# EAGLE board StepperBoard (EAGLE 9.6.2), part 1 of 2
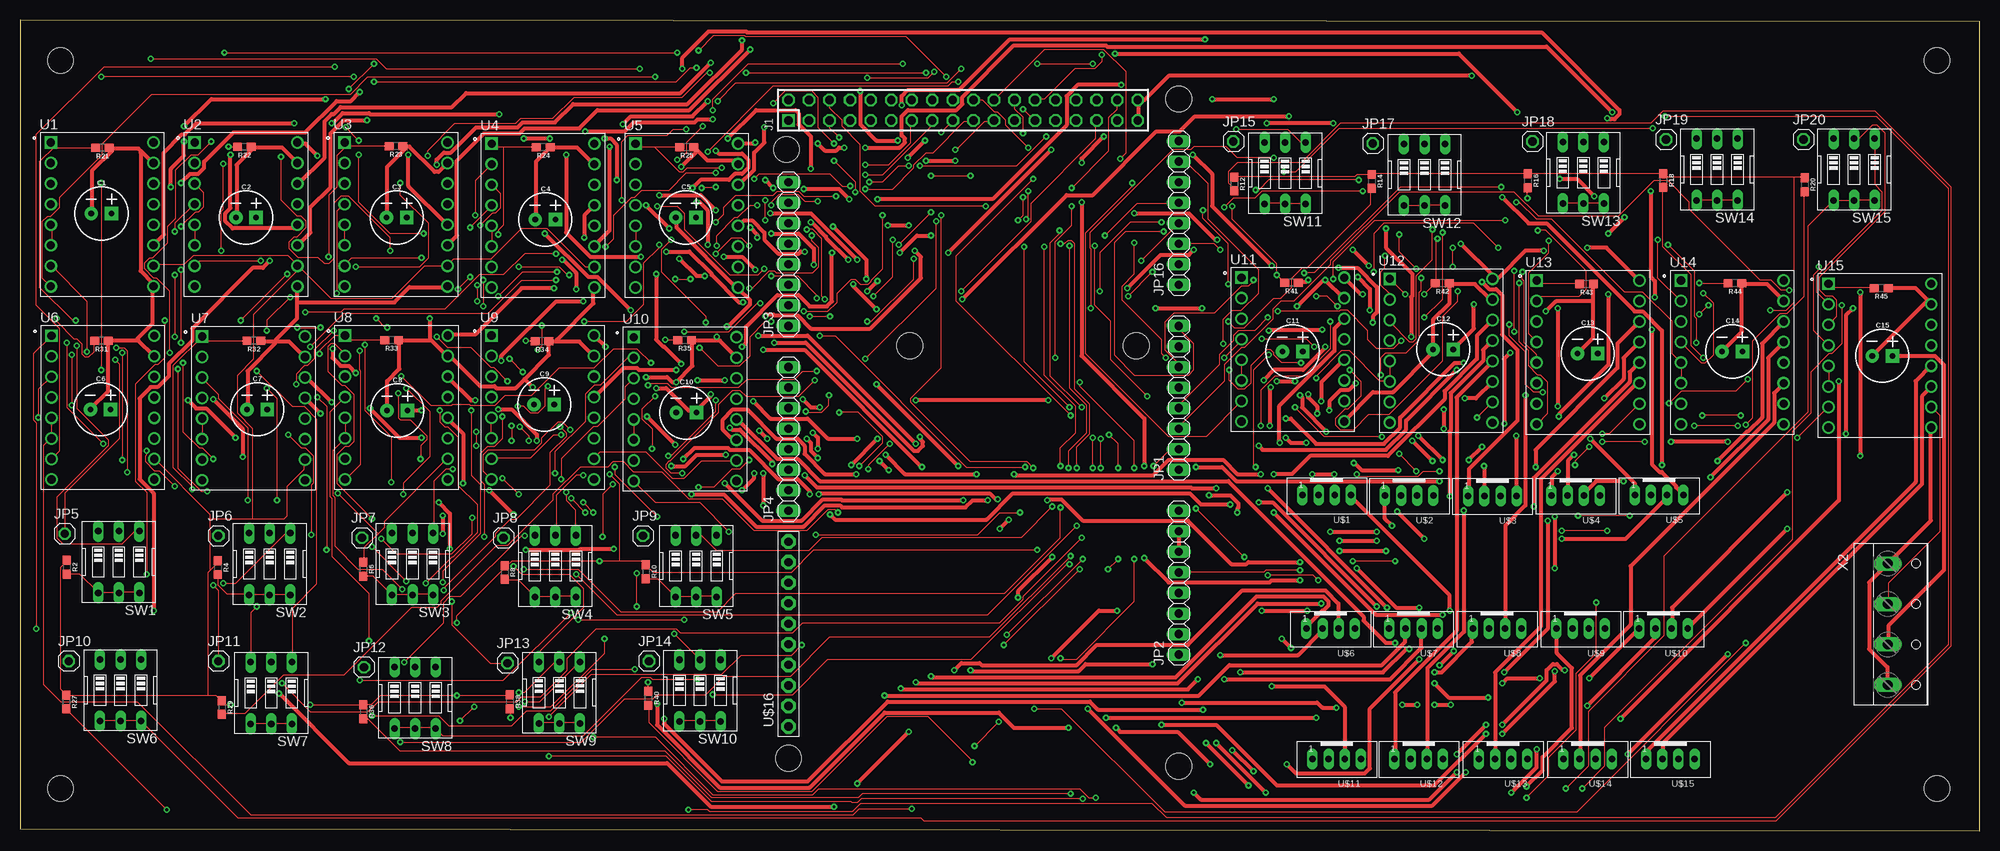
[diagram p3: board, top side]
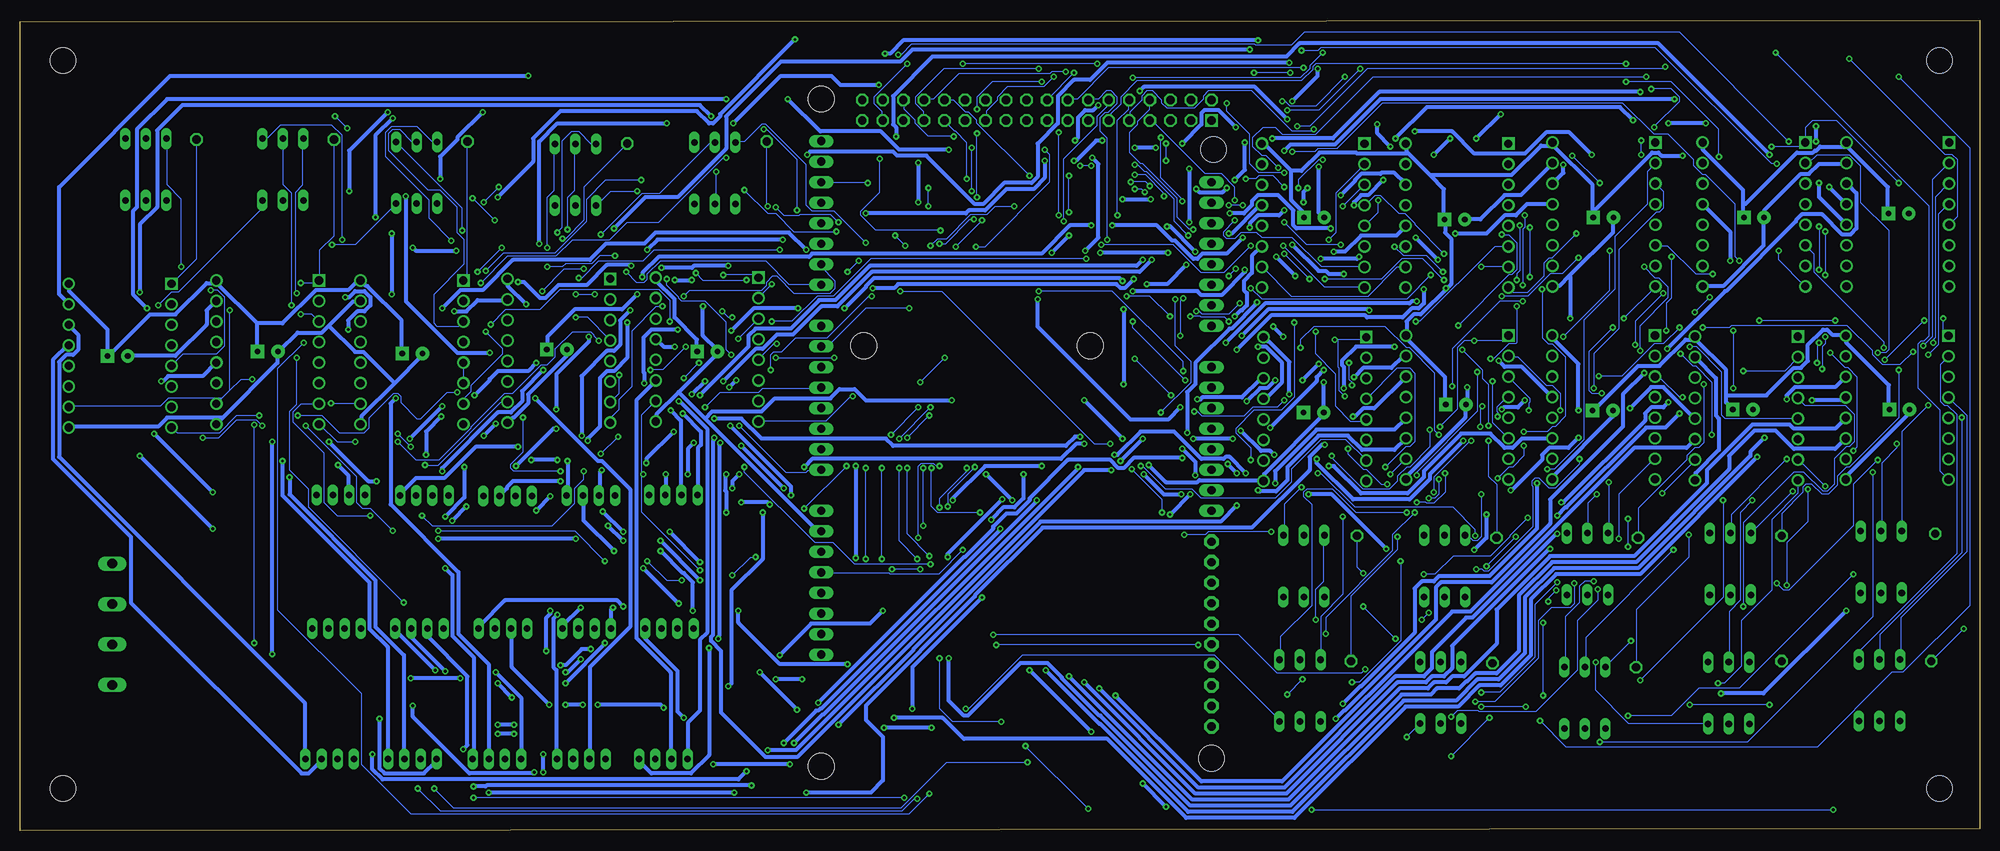
[diagram p4: board, bottom side, seen from below]

Size 242.3 x 100.2 mm. Coordinates in mm from the lower left corner, seen from the top.
Outline: 0,0.2 242.3,0 242.3,100 0,100.2 0,0.2
Copper layers (1*16): Top 0.035mm / dielectric 1.5mm / Bottom 0.035mm
Design rules "default": minimum track width 6mil, minimum drill 0.35mm, track to track 6mil, track to pad 6mil, pad to pad 6mil, via to via 6mil, smd to smd 6mil, copper to edge 40mil, drill to drill 6mil, minimum pad ring 10mil, minimum via ring 8mil, stop-mask expansion 4mil, vias tented up to drill 0mil, thermal gap 10mil
Net classes: 1 Motor: width 0.508 mm; 2 VMOT: width 0.508 mm; 3 GND: width 0.508 mm
Holes 3.2 mm at 5,95.2 5,5.2 237,5.2 237,95.2 94.75,84.2 95,8.95 143.25,90.45 143.25,7.95 110,59.95 138,59.95
tRestrict: area 1.8,92 to 8.2,98.4; area 1.8,2 to 8.2,8.4; area 233.8,2 to 240.2,8.4; area 233.8,92 to 240.2,98.4
bRestrict: area 1.8,92 to 8.2,98.4; area 1.8,2 to 8.2,8.4; area 233.8,2 to 240.2,8.4; area 233.8,92 to 240.2,98.4
vRestrict: area 1.8,92 to 8.2,98.4; area 1.8,2 to 8.2,8.4; area 233.8,2 to 240.2,8.4; area 233.8,92 to 240.2,98.4

## Footprints (pad centres in the part's own frame; a part is rotated, then mirrored left to right if it is on the bottom)
CPOL-RADIAL-2.5MM-6.5MM = drill 0.7 pad 1.651 square: 1 1.25,0 | drill 0.7 pad 1.651: 2 -1.25,0
DIL-100-2X18 = drill 1.016 square: 1 -21.59,-1.27 | drill 1.016 octagon: 2 -21.59,1.27; 3 -19.05,-1.27; 4 -19.05,1.27; 5 -16.51,-1.27; 6 -16.51,1.27; 7 -13.97,-1.27; 8 -13.97,1.27; 9 -11.43,-1.27; 10 -11.43,1.27; 11 -8.89,-1.27; 12 -8.89,1.27; 13 -6.35,-1.27; 14 -6.35,1.27; 15 -3.81,-1.27; 16 -3.81,1.27; 17 -1.27,-1.27; 18 -1.27,1.27; 19 1.27,-1.27; 20 1.27,1.27; 21 3.81,-1.27; 22 3.81,1.27; 23 6.35,-1.27; 24 6.35,1.27; 25 8.89,-1.27; 26 8.89,1.27; 27 11.43,-1.27; 28 11.43,1.27; 29 13.97,-1.27; 30 13.97,1.27; 31 16.51,-1.27; 32 16.51,1.27; 33 19.05,-1.27; 34 19.05,1.27; 35 21.59,-1.27; 36 21.59,1.27
1X08 = drill 1.016 long: 1 -8.89,0; 2 -6.35,0; 3 -3.81,0; 4 -1.27,0; 5 1.27,0; 6 3.81,0; 7 6.35,0; 8 8.89,0
1X01 = drill 1.016 octagon: 1 0,0
0603 = smd 1.1 x 1: 1 -0.85,0; 2 0.85,0
EDG-03 = drill 0.813 long: 1 -2.54,-3.81; 2 0,-3.81; 3 2.54,-3.81; 4 2.54,3.81; 5 0,3.81; 6 -2.54,3.81
MODULE_A4988_STEPPER_MOTOR_DRIVER_CARRIER = drill 1.02 square: 1 -6.35,8.89 | drill 1.02: 2 -6.35,6.35; 3 -6.35,3.81; 4 -6.35,1.27; 5 -6.35,-1.27; 6 -6.35,-3.81; 7 -6.35,-6.35; 8 -6.35,-8.89; 9 6.35,-8.89; 10 6.35,-6.35; 11 6.35,-3.81; 12 6.35,-1.27; 13 6.35,1.27; 14 6.35,3.81; 15 6.35,6.35; 16 6.35,8.89
JST_B4B-PH_HEADER = drill 0.8 long: P1 2.98,0.048; P2 0.98,0.048; P3 -1.02,0.048; P4 -3.02,0.048
1X10-BIG = drill 1.016 pad 1.778 octagon: 1 -11.43,0; 2 -8.89,0; 3 -6.35,0; 4 -3.81,0; 5 -1.27,0; 6 1.27,0; 7 3.81,0; 8 6.35,0; 9 8.89,0; 10 11.43,0
W237-4 = drill 1.194 long: 1 -7.5,-1.27; 2 -2.5,-1.27; 3 2.5,-1.27; 4 7.5,-1.27

## Placement (x,y rotation side)
C1  100uF  [CPOL-RADIAL-2.5MM-6.5MM]  10.04,76.3 0 top
C2  100uF  [CPOL-RADIAL-2.5MM-6.5MM]  27.92,75.8 0 top
C3  100uF  [CPOL-RADIAL-2.5MM-6.5MM]  46.55,75.8 0 top
C4  100uF  [CPOL-RADIAL-2.5MM-6.5MM]  64.93,75.55 0 top
C5  100uF  [CPOL-RADIAL-2.5MM-6.5MM]  82.31,75.8 0 top
C6  100uF  [CPOL-RADIAL-2.5MM-6.5MM]  9.93,52.08 0 top
C7  100uF  [CPOL-RADIAL-2.5MM-6.5MM]  29.3,52.08 0 top
C8  100uF  [CPOL-RADIAL-2.5MM-6.5MM]  46.62,51.93 0 top
C9  100uF  [CPOL-RADIAL-2.5MM-6.5MM]  64.79,52.68 0 top
C10  100uF  [CPOL-RADIAL-2.5MM-6.5MM]  82.36,51.68 0 top
C11  100uF  [CPOL-RADIAL-2.5MM-6.5MM]  157.33,59.25 0 top
C12  100uF  [CPOL-RADIAL-2.5MM-6.5MM]  175.95,59.5 0 top
C13  100uF  [CPOL-RADIAL-2.5MM-6.5MM]  193.82,59 0 top
C14  100uF  [CPOL-RADIAL-2.5MM-6.5MM]  211.69,59.25 0 top
C15  100uF  [CPOL-RADIAL-2.5MM-6.5MM]  230.25,58.7 0 top
J1  F-2X18-DIL-100  [DIL-100-2X18]  116.59,89.07 0 top
JP1  [1X08]  143.26,53.51 90 top
JP2  [1X08]  143.26,30.65 90 top
JP3  [1X08]  95,71.29 90 top
JP4  [1X08]  95,48.43 90 top
JP5  [1X01]  5.5,36.7 0 top
JP6  [1X01]  24.5,36.45 0 top
JP7  [1X01]  42.25,36.2 0 top
JP8  [1X01]  59.75,36.2 0 top
JP9  [1X01]  77,36.45 0 top
JP10  [1X01]  6,20.95 0 top
JP11  [1X01]  24.5,20.95 0 top
JP12  [1X01]  42.5,20.2 0 top
JP13  [1X01]  60.25,20.7 0 top
JP14  [1X01]  77.75,20.95 0 top
JP15  [1X01]  150,85.2 0 top
JP16  [1X08]  143.26,76.37 90 top
JP17  [1X01]  167.25,84.95 0 top
JP18  [1X01]  187,85.2 0 top
JP19  [1X01]  203.5,85.45 0 top
JP20  [1X01]  220.5,85.45 0 top
R2  4.7k  [0603]  5.75,32.56 270 top
R4  4.7k  [0603]  24.43,32.51 270 top
R6  4.7k  [0603]  42.41,32.31 270 top
R8  4.7k  [0603]  59.89,31.91 270 top
R10  4.7k  [0603]  77.37,32.01 270 top
R12  4.7k  [0603]  150.12,79.94 270 top
R14  4.7k  [0603]  167.12,80.27 270 top
R16  4.7k  [0603]  186.42,80.35 270 top
R18  4.7k  [0603]  203.17,80.38 270 top
R20  4.7k  [0603]  220.65,79.86 270 top
R21  4.7k  [0603]  10.17,84.42 180 top
R22  4.7k  [0603]  27.72,84.53 180 top
R23  4.7k  [0603]  46.47,84.64 180 top
R24  4.7k  [0603]  64.67,84.5 180 top
R25  4.7k  [0603]  82.42,84.51 180 top
R27  4.7k  [0603]  5.69,15.89 270 top
R29  4.7k  [0603]  24.94,15.22 270 top
R31  4.7k  [0603]  10.05,60.55 180 top
R32  4.7k  [0603]  28.89,60.55 180 top
R33  4.7k  [0603]  45.93,60.65 180 top
R34  4.7k  [0603]  64.52,60.5 180 top
R35  4.7k  [0603]  82.16,60.65 180 top
R36  4.7k  [0603]  42.44,14.7 270 top
R38  4.7k  [0603]  60.54,15.93 270 top
R40  4.7k  [0603]  77.67,16.36 270 top
R41  4.7k  [0603]  157.2,67.73 180 top
R42  4.7k  [0603]  175.84,67.68 180 top
R43  4.7k  [0603]  193.68,67.58 180 top
R44  4.7k  [0603]  212.02,67.68 180 top
R45  4.7k  [0603]  230.11,67.08 180 top
SW1  [EDG-03]  12.19,33.21 180 top
SW2  [EDG-03]  30.85,32.96 180 top
SW3  [EDG-03]  48.51,32.96 180 top
SW4  [EDG-03]  66.17,32.71 180 top
SW5  [EDG-03]  83.58,32.71 180 top
SW6  [EDG-03]  12.4,17.36 180 top
SW7  [EDG-03]  31.04,17.01 180 top
SW8  [EDG-03]  48.83,16.41 180 top
SW9  [EDG-03]  66.67,17.06 180 top
SW10  [EDG-03]  84.06,17.31 180 top
SW11  [EDG-03]  156.4,81.29 180 top
SW12  [EDG-03]  173.64,81.09 180 top
SW13  [EDG-03]  193.28,81.34 180 top
SW14  [EDG-03]  209.82,81.74 180 top
SW15  [EDG-03]  226.76,81.74 180 top
U1  A4988_STEPPER_MOTOR_DRIVER_CARRIER  [MODULE_A4988_STEPPER_MOTOR_DRIVER_CARRIER]  10.14,76.18 0 top
U2  A4988_STEPPER_MOTOR_DRIVER_CARRIER  [MODULE_A4988_STEPPER_MOTOR_DRIVER_CARRIER]  27.92,76.18 0 top
U3  A4988_STEPPER_MOTOR_DRIVER_CARRIER  [MODULE_A4988_STEPPER_MOTOR_DRIVER_CARRIER]  46.47,76.18 0 top
U4  A4988_STEPPER_MOTOR_DRIVER_CARRIER  [MODULE_A4988_STEPPER_MOTOR_DRIVER_CARRIER]  64.64,76.05 0 top
U5  A4988_STEPPER_MOTOR_DRIVER_CARRIER  [MODULE_A4988_STEPPER_MOTOR_DRIVER_CARRIER]  82.42,76.05 0 top
U6  A4988_STEPPER_MOTOR_DRIVER_CARRIER  [MODULE_A4988_STEPPER_MOTOR_DRIVER_CARRIER]  10.22,52.3 0 top
U7  A4988_STEPPER_MOTOR_DRIVER_CARRIER  [MODULE_A4988_STEPPER_MOTOR_DRIVER_CARRIER]  28.85,52.21 0 top
U8  A4988_STEPPER_MOTOR_DRIVER_CARRIER  [MODULE_A4988_STEPPER_MOTOR_DRIVER_CARRIER]  46.52,52.32 0 top
U9  A4988_STEPPER_MOTOR_DRIVER_CARRIER  [MODULE_A4988_STEPPER_MOTOR_DRIVER_CARRIER]  64.61,52.32 0 top
U10  A4988_STEPPER_MOTOR_DRIVER_CARRIER  [MODULE_A4988_STEPPER_MOTOR_DRIVER_CARRIER]  82.21,52.12 0 top
U11  A4988_STEPPER_MOTOR_DRIVER_CARRIER  [MODULE_A4988_STEPPER_MOTOR_DRIVER_CARRIER]  157.36,59.48 0 top
U12  A4988_STEPPER_MOTOR_DRIVER_CARRIER  [MODULE_A4988_STEPPER_MOTOR_DRIVER_CARRIER]  175.7,59.33 0 top
U13  A4988_STEPPER_MOTOR_DRIVER_CARRIER  [MODULE_A4988_STEPPER_MOTOR_DRIVER_CARRIER]  193.86,59.13 0 top
U14  A4988_STEPPER_MOTOR_DRIVER_CARRIER  [MODULE_A4988_STEPPER_MOTOR_DRIVER_CARRIER]  211.7,59.13 0 top
U15  A4988_STEPPER_MOTOR_DRIVER_CARRIER  [MODULE_A4988_STEPPER_MOTOR_DRIVER_CARRIER]  229.95,58.73 0 top
U$1  JST-PH_4-PIN_HEADER  [JST_B4B-PH_HEADER]  161.52,41.52 180 top
U$2  JST-PH_4-PIN_HEADER  [JST_B4B-PH_HEADER]  171.72,41.47 180 top
U$3  JST-PH_4-PIN_HEADER  [JST_B4B-PH_HEADER]  182.02,41.42 180 top
U$4  JST-PH_4-PIN_HEADER  [JST_B4B-PH_HEADER]  192.32,41.47 180 top
U$5  JST-PH_4-PIN_HEADER  [JST_B4B-PH_HEADER]  202.62,41.52 180 top
U$6  JST-PH_4-PIN_HEADER  [JST_B4B-PH_HEADER]  162.01,25.02 180 top
U$7  JST-PH_4-PIN_HEADER  [JST_B4B-PH_HEADER]  172.25,25.02 180 top
U$8  JST-PH_4-PIN_HEADER  [JST_B4B-PH_HEADER]  182.59,25.02 180 top
U$9  JST-PH_4-PIN_HEADER  [JST_B4B-PH_HEADER]  192.93,25.02 180 top
U$10  JST-PH_4-PIN_HEADER  [JST_B4B-PH_HEADER]  203.17,25.02 180 top
U$11  JST-PH_4-PIN_HEADER  [JST_B4B-PH_HEADER]  162.76,8.9 180 top
U$12  JST-PH_4-PIN_HEADER  [JST_B4B-PH_HEADER]  172.9,8.9 180 top
U$13  JST-PH_4-PIN_HEADER  [JST_B4B-PH_HEADER]  183.34,8.9 180 top
U$14  JST-PH_4-PIN_HEADER  [JST_B4B-PH_HEADER]  193.78,8.9 180 top
U$15  JST-PH_4-PIN_HEADER  [JST_B4B-PH_HEADER]  204.02,8.9 180 top
U$16  PINHD-1X10  [1X10-BIG]  95,24.3 90 top
X2  [W237-4]  232.19,25.51 270 top

## Tracks (layer width: path | path; a pad name or v marks a point on that pad's centre or on a via)
5V  (via drill 0.35)
  Top 0.152: R12.1 150.12,80.83 165,80.83 165.25,81.08 167,81.08 R14.1 167.12,81.2 R16.1 203.12,81.2 R18.1 203.25,81.2 203.62,80.83 219.38,80.83 | 219.38,80.83 220.62,80.83 R20.1 | v203.88,52.83 205.38,54.33 212.12,54.33 v213.62,55.83 | v192.25,45.2 192.25,45.7 v194,47.45 | v195.62,49.08 196.5,49.08 200.12,52.7 U13.10 | X2.2 231,28.07 231,30.57 237.38,36.95 237.38,51.33 236.38,52.33 U15.10 | 219.38,80.83 219.38,65.33 218.38,64.33 v216.38,64.33 | v158.25,32.2 154,32.2 153.75,31.95 143.38,31.95 JP2.5 | U10.10 88.5,45.7 84.25,45.7 82.12,43.58 80.62,43.58 77.38,46.83 71.75,46.83 71,46.08 U9.10 | 74.12,33.33 76.88,33.33 77.25,32.95 R10.1 77.38,32.83 78.25,31.95 95.38,31.95 98.12,34.7 v125.75,34.7 | 74.12,33.33 v71.62,33.33 60.75,33.33 60.25,32.83 60,32.83 R8.1 59.88,32.7 59.88,32.45 54,26.57 v54,25.7 | v77.62,18.32 77.62,17.32 R40.1 | v72.88,44.08 74.12,42.83 74.12,33.33 | U1.10 16.5,69.95 20.25,69.95 21.38,71.08 33.12,71.08 34.25,69.95 U2.10 | 34.62,69.58 34.38,69.83 U2.10 | 34.62,69.58 38.38,65.83 46,65.83 50,69.83 52.75,69.83 U3.10 52.88,69.95 53.62,70.7 58.25,70.7 62,74.45 65.12,74.45 69.88,69.7 U4.10 | 44.25,36.7 45,37.45 45,38.2 52.75,45.95 U8.10 | 44.25,36.7 42.5,34.95 42.5,33.2 R6.1 | R38.1 60.5,16.7 v54,16.7 44.5,16.7 43.38,15.57 42.5,15.57 R36.1 42.38,15.57 v35.88,15.57 | 23.25,16.7 24.25,16.7 24.88,16.07 R29.1 25,15.95 25.38,15.57 v26,15.57 | 23.25,16.7 5.75,16.7 R27.1 5.62,16.82 5,17.45 5,32.58 5.75,33.33 R2.1 | 23.5,32.2 23.25,31.95 23.25,16.7 | 23.5,32.2 24.38,33.08 24.38,33.33 R4.1 | 23.5,32.2 23.5,38.58 | 23.5,38.58 23.5,39.08 16.62,45.95 U6.10 | 23.5,38.58 28.75,38.58
  Top 0.152: 28.75,38.58 32.62,38.58 33,38.95 33,42.58 35.12,44.7 35.12,45.83 U7.10 | v39.25,41.7 44.25,36.7 | 34.62,69.58 28.88,63.83 28.88,58.33 26.88,56.33 26.88,51.58 28.75,49.7 28.75,38.58 | 34.62,69.58 U2.10 | v180.12,51.08 182,52.95 U12.10 | v175.5,44.45 173.5,44.45 172.88,43.83 165.5,43.83 v165.25,44.08
  Bottom 0.152: v203.88,52.83 200.25,52.83 U13.10 | v213.62,55.83 215,55.83 216.38,54.45 | 217.38,53.45 218,52.83 U14.10 | 217.38,53.45 216.38,54.45 | 217.38,53.45 224,53.45 225,52.45 236.25,52.45 U15.10 | v192.25,45.2 190.62,45.2 182.88,52.95 182.12,52.95 U12.10 | v195.62,49.08 v194,47.45 | 216.38,54.45 v216.38,64.33 | v158.25,32.2 165.5,39.45 165.5,44.08 | 165.5,44.08 165.5,51.33 163.75,53.08 U11.10 | v77.62,18.32 76.75,18.32 71.62,23.45 v71.62,33.33 | v72.88,44.08 71,45.95 U9.10 | v125.75,34.7 128.75,31.7 134.75,31.7 134.88,31.82 143.25,31.82 JP2.5 | U4.10 72,69.7 75.62,66.08 85.12,66.08 88.75,69.7 U5.10 | v26,15.57 v35.88,15.57 | v39.25,41.7 35.12,45.83 U7.10 | v54,16.7 v54,25.7 | v180.12,51.08 180.12,46.83 181.62,45.33 181.62,44.83 181.25,44.45 v175.5,44.45 | 165.5,44.08 v165.25,44.08
GND  (via drill 0.35)
  Top 0.508: J1.35 138.25,87.83 138.25,90.33 J1.36 138.5,90.33 139,90.33 142,93.33 v179.5,93.33 | R45.1 231,67.08 234.38,67.08 236.25,65.2 U15.15 235.75,65.45 C15.2 | 83.75,84.08 85,82.83 88.38,82.83 88.75,82.45 U5.15 | 83.75,84.08 83.38,84.45 R25.1 | C5.2 81.12,75.7 81.12,74.58 88.5,67.2 88.75,67.2 U5.9 88.88,66.95 90.25,65.58 90.25,65.08 87.5,62.33 v87.38,62.33 | v81.75,82.08 83.75,84.08 | 86.12,60.58 86.5,60.58 88.5,58.58 U10.15 | 86.12,60.58 83.12,60.58 R35.1 83.12,60.33 83.12,57.45 v81.12,55.45 80.62,55.45 80,56.08 v77.38,56.08 | 66.38,60.45 69.12,60.45 70.88,58.7 U9.15 | 66.38,60.45 65.38,60.45 R34.1 65.38,60.2 65.38,58.83 62.38,55.83 | U4.9 70.88,67.08 70.88,65.2 66.38,60.7 66.38,60.45 | 50.62,60.58 50.88,60.58 52.75,58.7 U8.15 53.12,58.7 56.88,54.95 58.62,54.95 58.88,54.7 61.25,54.7 62.38,55.83 | 50.62,60.58 46.88,60.58 R33.1 46.88,60.33 46.88,57.08 45.38,55.58 45.38,51.95 C8.2 | 62.38,55.83 v63.38,54.83 | v86.12,61.08 86.12,60.58 | U4.15 70.88,82.45 68.88,84.45 65.62,84.45 R24.1 65.38,84.33 63.75,82.7 63.75,75.58 C4.2 | U3.15 52.75,82.45 51.75,81.45 51.25,81.45 48.12,84.58 47.38,84.58 R23.1 47.38,84.33 47.38,84.08 45.38,82.08 45.38,75.83 C3.2 | 14.5,60.58 14.62,60.58 16.5,58.7 U6.15 | 14.5,60.58 11,60.58 R31.1 10.88,60.33 10.88,54.33 8.75,52.2 C6.2 | 14.5,60.58 14.5,60.83 16.38,62.7 16.38,67.2 U1.9 16.38,67.45 16.38,67.7 14.88,69.2 14.88,83.83 15,83.95 | 31.62,60.45 33.25,60.45 35.12,58.58 U7.15 | 31.62,60.45 31.5,60.45 | 31.5,60.45 29.75,60.45 R32.1 | 34.25,65.33 34.25,63.33 31.62,60.7 31.62,60.45 | 34.25,65.33 34.25,67.2 U2.9 | C7.2 28.12,52.2 28.12,56.83 31.5,60.2 31.5,60.45
  Top 0.508: 15,83.95 16.38,82.58 U1.15 | 15,83.95 14.62,84.33 11.12,84.33 R21.1 11.38,84.08 8.88,81.58 8.88,76.33 C1.2 | U2.15 34.25,82.58 32.38,84.45 28.62,84.45 R22.1 28.62,84.2 26.75,82.33 26.75,75.83 C2.2 | 34.25,65.33 46.25,65.33 48.12,67.2 52.75,67.2 U3.9 | v50.62,63.33 50.62,60.58 | U12.15 182,65.7 181.75,65.7 179.88,67.58 176.75,67.58 R42.1 176.75,67.33 176.75,65.2 174.75,63.2 174.75,59.58 C12.2 174.62,59.33 174.62,59.08 169.75,54.2 167.25,54.2 163.75,50.7 U11.9 | v159.25,68.08 159,67.83 158.12,67.83 R41.1 | U11.15 163.62,65.83 v161.38,68.08 161.12,68.08 v157.88,64.83 | JP2.6 143.25,34.58 143.25,36.95 JP2.7 | U15.9 236.25,49.83 236.25,38.33 231,33.08 X2.1 230.75,32.83 228.62,30.7 228.62,22.45 230.88,20.2 230.88,18.07 X2.4 | 194.5,65.45 194.5,60.95 192.62,59.08 C13.2 | 194.5,65.45 194.5,67.58 R43.1 | U14.15 218,65.58 216,67.58 212.88,67.58 R44.1 212.88,67.33 212.88,61.7 210.5,59.33 C14.2 | v188.62,64.2 189.88,65.45 194.5,65.45 | v106,48.45 v102.75,45.2 | v127.12,53.2 v110.75,53.2
  Bottom 0.508: v179.5,93.33 223.75,93.33 237.5,79.58 237.5,66.33 236.38,65.2 U15.15 | v81.75,82.08 81.75,76.45 81.12,75.83 C5.2 | v81.12,55.45 81.12,51.83 C10.2 81,51.58 88.5,44.08 88.5,43.33 U10.9 88.75,43.33 96.5,43.33 96.75,43.08 100.62,43.08 v102.75,45.2 | U9.9 70.88,43.45 70.88,43.83 63.62,51.08 63.62,52.58 C9.2 63.38,52.83 v63.38,54.83 | U8.9 52.75,43.45 52.75,43.83 45.38,51.2 45.38,51.83 C8.2 | v77.38,56.08 76.25,57.2 72.75,57.2 71.38,58.58 71,58.58 U9.15 | v86.12,61.08 v87.38,62.33 | 50.75,68.58 45.38,73.95 45.38,75.7 C3.2 | 50.75,68.58 52,67.33 52.75,67.33 U3.9 | C4.2 63.62,75.58 61.75,75.58 58.75,78.58 56.75,78.58 52.88,82.45 U3.15 | U6.9 16.5,43.45 16.5,43.83 8.75,51.58 8.75,52.08 C6.2 | U7.9 35.12,43.33 35.12,44.2 32.25,47.08 32.25,50.95 32.62,51.33 32.62,55.95 35.12,58.45 U7.15 | U1.15 16.5,82.45 19.88,82.45 21.12,81.2 22.12,81.2 26.62,76.7 26.62,75.83 C2.2 26.75,75.58 26.75,72.33 31.75,67.33 34.25,67.33 U2.9 | v50.62,63.33 50.62,68.45 50.75,68.58 | U12.9 182,50.45 181.38,51.08 181.25,51.08 179.5,52.83 179.5,53.95 174.75,58.7 174.75,59.45 C12.2 | v161.38,68.08 v159.25,68.08 | 160.88,54.2 156.12,58.95 156.12,59.2 C11.2 156.12,59.45 157.88,61.2 v157.88,64.83 | 160.88,54.2 163.62,51.45 163.62,50.7 U11.9 | 160.88,54.2 157.62,50.95 | 157.62,50.95 143.75,37.08 143.38,37.08 JP2.7 | 196,55.33 192.62,58.7 192.62,58.95 C13.2 | 196,55.33 200.12,51.2 200.12,50.33 U13.9 | 217.38,50.95 210.5,57.83 210.5,59.2 C14.2 210.25,59.33 208,61.58 205,61.58 204.12,62.45 | 217.38,50.95 218,50.33 U14.9 | 204.12,62.45 201.12,65.45 200.25,65.45 U13.15 | 196,55.33 199.88,59.2 200.88,59.2 204.12,62.45
  Bottom 0.508: U15.9 236.25,49.95 225.25,49.95 224.12,51.08 217.5,51.08 217.38,50.95 | v188.62,64.2 187.12,64.2 185.75,65.58 182.12,65.58 U12.15 | v110.75,53.2 v106,48.45 | v127.12,53.2 137.75,53.2 139.12,54.58 141,54.58 142.12,53.45 149,53.45 150.62,51.83 156.75,51.83 157.62,50.95 | C15.2 223.12,58.7 219.25,62.58 219.25,64.33 218.12,65.45 U14.15
N$1  (via drill 0.35)
  Top 0.152: v119.38,77.2 105.75,77.2 103.88,79.08 103.88,84.83 101.62,87.08 101.62,87.83 100.12,89.33 100.12,90.33 J1.6 | v129.75,72.33 129.75,54.7 131.88,52.58 131.88,49.2 129.62,46.95 v129.62,44.83 | v123.62,39.33 121.12,39.33 118.38,36.58 v98.38,36.58 | v87.62,36.95 84,40.58 78.5,40.58 75.88,43.2 U10.8
  Bottom 0.152: v119.38,77.2 121.75,77.2 122.75,76.2 124.75,76.2 127.75,73.2 128.88,73.2 v129.75,72.33 | v129.62,44.83 129.62,40.08 128.88,39.33 v123.62,39.33 | v98.38,36.58 95.75,36.58 95.38,36.95 v87.62,36.95
N$2  (via drill 0.35)
  Top 0.152: v97.25,74.33 98,74.33 99.12,73.2 99.12,66.08 v99.5,65.7 | v101.25,51.7 103.62,51.7 106.62,48.7 106.62,47.95 v103.75,45.08
  Bottom 0.152: v97.25,74.33 97.75,74.33 99.25,75.83 99.25,78.2 103.5,82.45 103.75,82.45 105.12,83.83 105.12,86.33 104.12,87.33 104.12,87.7 102.62,89.2 102.62,90.33 J1.8 | v99.5,65.7 99.5,59.95 97.5,57.95 97.5,55.45 v101.25,51.7 | v103.75,45.08 103.5,45.08 100.62,42.2 97.38,42.2 96.25,41.08 87.12,41.08 85.12,43.08 85.12,44.7 81.5,48.33 78.38,48.33 75.88,45.83 U10.7
N$3  (via drill 0.35)
  Top 0.152: 4.25,84.58 3.88,84.95 U1.1 4.25,84.58 | 4.25,84.58 4.38,84.45 9.25,84.45 R21.2 | JP5.1 5.5,41.7 12.25,48.45 12.25,57.7 v11.75,58.2 | v6.88,63.08 6.5,63.08 2.38,67.2 2.38,82.7 4.25,84.58
  Bottom 0.152: v6.88,63.08 v11.75,58.2
N$4  (via drill 0.35)
  Top 0.152: v106.62,76.08 106.62,69.45 105.25,68.08 105.25,67.95 104.88,67.58 103.88,67.58 103.25,68.2 102.75,68.2 101,66.45 101,65.33 99.88,64.2 v96.88,64.2 | v91.5,65.2 91.12,65.2 87.62,61.7 v82.12,61.7 | U10.6 75.88,48.33 75.88,50.83 U10.5
  Bottom 0.152: v106.62,76.08 106.62,87.83 105.25,89.2 105.25,90.33 J1.10 | v96.88,64.2 96.5,64.2 96.12,63.83 92.88,63.83 v91.5,65.2 | v82.12,61.7 82.12,58.95 79.62,56.45 79.62,52.45 77.75,50.58 76.12,50.58 75.88,50.83 U10.5
N$5  (via drill 0.35)
  Top 0.152: SW7.4 SW7.5 SW7.6 | v149.38,62.95 150.12,62.2 151.38,62.2 155,65.83 155.88,65.83 157.25,67.2 157.25,68.33 158.5,69.58 159.12,69.58 167,77.45 167,79.33 R14.2 | v110.5,70.7 110.5,68.2 105.25,62.95 v104.75,62.95 | v98.25,55.7 96.25,53.7 89.75,53.7 89,54.45 88.12,54.45 86.38,52.7 86.38,51.7 80.38,45.7 80.25,45.7 79.88,45.33 79.88,44.83 80.5,44.2 v81.88,44.2 | v62.38,36.45 62,36.45 54.5,28.95 53.12,28.95 52.38,28.2 52.38,25.7 v47.5,20.82
  Bottom 0.152: v149.38,62.95 146.88,62.95 143.75,66.08 141.75,66.08 137.12,70.7 v110.5,70.7 | v104.75,62.95 104.75,62.2 v98.25,55.7 | v81.88,44.2 81.5,44.2 77.25,39.95 65.12,39.95 62.38,37.2 v62.38,36.45 | v47.5,20.82 47.5,17.32 43.38,13.2 SW7.6
N$6  (via drill 0.35)
  Top 0.152: SW7.3 28.5,26.95 v29.25,27.7
  Bottom 0.152: v29.25,27.7 29.25,38.08 23,44.33 21.75,44.33 19.38,41.95 18.88,41.95 18,42.83 18,45.95 16.5,47.45 16.12,47.45 15.5,48.08 15.5,51.45 16.62,52.58 21.62,52.58 22.5,53.45 U7.4
N$7  (via drill 0.35)
  Top 0.152: v28.12,40.83 28.12,49.83 24.5,53.45 24.5,53.95 22.5,55.95 U7.3
  Bottom 0.152: v28.12,40.83 29.62,39.33 29.62,28.45 31,27.07 31,20.82 SW7.2
N$8  (via drill 0.35)
  Top 0.152: v101.25,85.7 100.12,86.83 100.12,87.7 J1.5 | v98.62,77.83 97,77.83 96.12,78.7 93.88,78.7 92.88,77.7 v92.88,77.33 | v91.12,77.33 90.25,77.33 88.75,75.83 88.38,75.83 86.12,73.58 v86.12,72.33
  Bottom 0.152: v101.25,85.7 101.25,80.7 98.62,78.08 v98.62,77.83 | v91.12,77.33 v92.88,77.33 | v86.12,72.33 81,67.2 76.12,67.2 U5.8
N$9
  Top 0.152: R4.2 24.5,31.57 24.5,30.32 25.62,29.2 28.25,29.2 SW2.4 28.38,29.2 30.75,29.2 SW2.5 30.88,29.2 33.38,29.2 SW2.6
N$10  (via drill 0.35)
  Top 0.152: v23.12,41.95 22.38,41.95 19.5,44.83 v19.5,57.08 | v19.12,68.7 v19.12,61.08 | v19.12,74.08 19.12,75.08 21.5,77.45 U2.4
  Bottom 0.152: v23.12,41.95 28.25,36.83 SW2.3 | v19.5,57.08 19.5,59.83 19.12,60.2 v19.12,61.08 | v19.12,74.08 v19.12,68.7
N$11  (via drill 0.35)
  Top 0.152: v23.88,45.95 22.5,47.33 22.12,47.33 20.12,49.33 v20.12,57.83 | v19.88,69.33 v19.88,60.33 | v19.88,74.7 21.62,76.45 22,76.45 22.62,77.08 22.62,78.95 21.62,79.95 U2.3
  Bottom 0.152: v23.88,45.95 30.75,39.08 30.75,36.83 SW2.2 | v20.12,57.83 20.12,60.08 v19.88,60.33 | v19.88,74.7 v19.88,69.33
N$12  (via drill 0.35)
  Top 0.152: v25.12,30.57 26.62,30.57 32.75,36.7 33.38,36.7 SW2.1 | v12.62,59.08 v12.62,45.83
  Bottom 0.152: v25.12,30.57 24.25,29.7 23.62,29.7 15.62,37.7 15.62,42.83 v12.62,45.83 | v12.62,59.08 11.62,59.08 11.25,59.45 11.25,74.2 14.75,77.7 14.75,82.2 16.12,83.58 20.12,83.58 21.12,82.58 21.5,82.58 U2.2
N$13  (via drill 0.35)
  Top 0.508: v176.75,27.2 176.75,29.07 164.62,41.2 164.62,41.45 U$1.P4 | v175.5,20.45 v177.25,22.2 | v171.75,22.45 171.38,22.45 168.5,19.57 v150.88,19.57 | v146.25,14.95 133.25,14.95 132.25,15.95 107.25,15.95 97.38,6.08 86.75,6.08 79.62,13.2 v79.62,13.82 | v41.5,56.58 40.62,57.45 39.62,57.45 38.62,58.45 v38.62,59.58
  Bottom 0.508: v176.75,27.2 176.75,26.82 177.25,26.32 v177.25,22.2 | v175.5,20.45 174.88,20.45 172.88,22.45 v171.75,22.45 | v146.25,14.95 v150.88,19.57 | v79.62,13.82 78.62,14.82 78.5,14.82 67.25,26.07 67.25,30.07 66.62,30.7 60.38,30.7 53.12,37.95 53.12,40.95 44.12,49.95 44.12,53.95 v41.5,56.58 | v38.62,59.58 31.5,66.7 31.38,66.7 22.75,75.33 22.75,75.45 22,76.2 19.5,76.2 17,73.7 16,73.7 15.25,74.45 15.25,78.83 16.38,79.95 U1.14
N$14  (via drill 0.35)
  Top 0.508: v159.75,44.08 v162.5,44.08 | v159,47.95 157.12,47.95 v156.5,48.58 | v106.25,45.7 v107.38,44.58 | v103.5,48.45 99.88,48.45 97.38,50.95 92.75,50.95 v90.62,53.08 | v83.75,55.7 v87.12,55.7 | v81.75,57.7 79.62,59.83 79.5,59.83 78.62,60.7 v78.62,68.83 | v85,72.45 85,76.7 84,77.7 v83.62,77.7 | v83.12,79.45 84.12,80.45 87.62,80.45 88.38,81.2 89.25,81.2 90,81.95 90,82.95 89.25,83.7 86.38,83.7 v86,84.08 | v37.75,90.45 23.62,90.45 v20.25,87.08 | v20.25,85.2 20.25,83.45 18.62,81.83 v18.62,79.58
  Bottom 0.508: v162.5,44.08 162.5,41.58 U$1.P3 | v159.75,44.08 159.75,47.2 v159,47.95 | v156.5,48.58 156.5,48.33 156.62,48.2 156.62,24.2 156.88,23.95 156.88,23.45 155.62,22.2 155.62,14.57 150.12,9.07 146.25,9.07 110.75,44.58 v107.38,44.58 | v103.5,48.45 v106.25,45.7 | v90.62,53.08 89,54.7 88.12,54.7 v87.12,55.7 | v81.75,57.7 v83.75,55.7 | v78.62,68.83 80.5,68.83 80.88,69.2 81.75,69.2 v85,72.45 | v83.62,77.7 83.62,78.95 v83.12,79.45 | v86,84.08 85.25,84.83 79.75,84.83 74.12,90.45 v37.75,90.45 | v20.25,85.2 v20.25,87.08 | v18.62,79.58 U1.13
N$15  (via drill 0.35)
  Top 0.508: v161.88,51.95 161.88,53.08 163.25,54.45 164.25,54.45 v165.12,55.33 | v161,61.95 154.5,61.95 v154.38,61.83 | v140.38,64.58 v146.12,64.58 | v104.75,66.7 v106,67.95 | v90.88,69.33 89.25,70.95 v87,70.95 | v84.62,68.58 83.62,68.58 v81.5,70.7 | v76.75,70.95 70.5,70.95 67.5,73.95 v67.5,83.58 | v62.25,85.58 v65.5,85.58 | v59.25,88.58 43.25,88.58 43.12,88.7 39.88,88.7 38.62,87.45 v38.5,87.45 | v33.88,87.45 21.75,87.45 20.38,86.08 20,86.08 17.75,83.83 17.75,73.7 16.5,72.45 U1.11
  Bottom 0.508: v161.88,51.95 160.62,50.7 160.62,41.58 U$1.P2 | v165.12,55.33 165.12,56.58 165.25,56.7 165.25,60.95 164.25,61.95 v161,61.95 | v154.38,61.83 151.62,64.58 v146.12,64.58 | v140.38,64.58 137.75,67.2 137.75,67.33 136.75,68.33 106.38,68.33 v106,67.95 | v104.75,66.7 96.75,66.7 96.25,66.2 93.75,66.2 90.88,69.08 v90.88,69.33 | v84.62,68.58 v87,70.95 | v81.5,70.7 77,70.7 v76.75,70.95 | v65.5,85.58 v67.5,83.58 | v59.25,88.58 v62.25,85.58 | v33.88,87.45 v38.5,87.45
N$16  (via drill 0.35)
  Top 0.508: v160.38,51.58 160.38,52.45 159.25,53.58 v159.25,53.95 | v155.38,55.58 v157.62,55.58 | v102.38,70.58 99.62,73.33 99.62,73.45 97.88,75.2 v97.75,75.2 | v97.75,81.83 97.75,85.83 96.25,87.33 96.25,88.7 95.88,89.08 91,89.08 v87.5,85.58 | v42,91.33 40.88,90.2 39.12,90.2 35.25,86.33 26.38,86.33 22.75,82.7 22.75,81.95 22,81.2 21,81.2 v19.88,80.08
  Bottom 0.508: v160.38,51.58 158.12,49.33 158.12,47.7 158.5,47.33 158.5,41.58 U$1.P1 | v157.62,55.58 v159.25,53.95 | v155.38,55.58 151.38,59.58 150.5,59.58 148.75,61.33 146.75,61.33 143.25,64.83 141.25,64.83 137,69.08 103.88,69.08 v102.38,70.58 | v97.75,81.83 v97.75,75.2 | v87.5,85.58 80,85.58 74.25,91.33 v42,91.33 | v19.88,80.08 19.88,78.33 16.5,74.95 U1.12
N$17  (via drill 0.35)
  Top 0.508: v169.62,37.7 168.75,38.58 168.75,41.33 U$2.P1 | v163.12,35.83 v167.75,35.83 | v158.25,30.95 154.75,30.95 154.5,30.7 142,30.7 v139,33.7 | v139,45.08 139,50.95 131.25,58.7 v131.25,77.7 | v131.25,82.58 131.25,83.08 v134,85.83 | v26,83.58 26,76.95 25.38,76.33 25.38,75.33 26.25,74.45 33.88,74.45 34.25,74.83 U2.12
  Bottom 0.508: v167.75,35.83 v169.62,37.7 | v158.25,30.95 v163.12,35.83 | v139,45.08 v139,33.7 | v131.25,82.58 v131.25,77.7 | v134,85.83 134,86.95 134.38,87.33 134.38,90.83 129.5,95.7 85.75,95.7 84.12,97.33 39.75,97.33 v26,83.58
N$18  (via drill 0.35)
  Top 0.152: v6.38,58.83 v6.38,52.58
  Bottom 0.152: v6.38,52.58 9.62,49.33 9.62,37.08 SW1.3 | v6.38,58.83 5.12,60.08 5.12,76.2 3.88,77.45 U1.4
N$19  (via drill 0.35)
  Top 0.152: v10.25,47.83 5.75,52.33 v5.75,60.33
  Bottom 0.152: v10.25,47.83 10.25,47.33 12.12,45.45 12.12,37.08 SW1.2 | v5.75,60.33 5.75,60.7 5.5,60.95 5.5,78.33 3.88,79.95 U1.3
N$20  (via drill 0.35)
  Top 0.152: v7,59.95 7,52.2 10.88,48.33 10.88,47.58 4.5,41.2 4.5,36.2 5.25,35.45 12.62,35.45 14.12,36.95 14.62,36.95 SW1.1
  Bottom 0.152: v7,59.95 5.88,61.08 5.88,80.45 3.88,82.45 U1.2
N$21
  Top 0.152: SW1.6 14.62,29.45 12.25,29.45 SW1.5 12.12,29.45 9.75,29.45 SW1.4 9.62,29.45 7.38,31.7 R2.2
N$22
  Top 0.152: SW3.6 51,29.2 48.62,29.2 SW3.5 48.5,29.2 46,29.2 SW3.4 45.88,29.2 43.62,31.45 42.5,31.45 R6.2
N$23  (via drill 0.35)
  Top 0.152: v45.88,43.08 45.88,48.7 42.62,51.95 v42.62,60.08 | v39.12,66.45 39.12,76.58 40,77.45 U3.4
  Bottom 0.152: v45.88,43.08 45.88,36.83 SW3.3 | v42.62,60.08 42.62,62.95 v39.12,66.45
N$24  (via drill 0.35)
  Top 0.152: v47.38,41.58 47.38,42.95 50.62,46.2 50.62,51.83 v47.75,54.7
  Bottom 0.152: v47.38,41.58 48.5,40.45 48.5,36.83 SW3.2 | v47.75,54.7 47.75,58.95 44.62,62.08 44.62,71.83 40,76.45 39.62,76.45 39.12,76.95 39.12,79.08 40,79.95 U3.3
N$25  (via drill 0.35)
  Top 0.152: v53.5,44.7 52.62,44.7 51.12,43.2 51.12,36.83 SW3.1
  Bottom 0.152: v53.5,44.7 52.62,44.7 49,48.33 49,63.08 45.12,66.95 45.12,73.45 41.12,77.45 41.12,81.45 40.12,82.45 U3.2
N$26
  Top 0.152: SW4.6 68.62,28.95 66.25,28.95 SW4.5 66.12,28.95 63.75,28.95 SW4.4 63.62,28.95 61.62,30.95 60,30.95 R8.2
N$27  (via drill 0.35)
  Top 0.152: v59.62,43.58 v61.62,41.58 | v56.38,49.33 v56.38,47.58 | v55.62,68.45 v54.12,66.95 | v55.62,74.58 58.25,77.2 U4.4
  Bottom 0.152: v61.62,41.58 61.62,36.33 62.12,35.83 62.62,35.83 63.25,36.45 63.62,36.45 SW4.3 | v59.62,43.58 58.25,44.95 57.75,44.95 56.38,46.33 v56.38,47.58 | v56.38,49.33 53.5,49.33 52.88,49.95 52.5,49.95 51.25,51.2 51.25,58.58 52.88,60.2 53.38,60.2 54.12,60.95 v54.12,66.95 | v55.62,74.58 v55.62,68.45
N$28  (via drill 0.35)
  Top 0.152: v69.62,43.95 68.75,43.95 66.25,41.45 66.25,36.58 SW4.2 | v60.5,58.33 v62.12,56.7 | v57.25,68.08 v57.25,64.83 | v56.88,74.83 58.38,76.33 58.75,76.33 59.38,76.95 59.38,78.83 58.38,79.83 U4.3
  Bottom 0.152: v69.62,43.95 69.62,44.33 62.12,51.83 v62.12,56.7 | v60.5,58.33 60.12,58.33 58.25,60.2 57.38,60.2 57.25,60.33 v57.25,64.83 | v57.25,68.08 57.25,68.83 56.88,69.2 v56.88,74.83
N$29  (via drill 0.35)
  Top 0.152: v67.5,41.83 67.5,40.83 68.62,39.7 68.62,36.58 SW4.1 | v62.88,48.2 62.88,48.83 v61.75,49.95 | v61.5,52.45 62.25,52.45 63.12,51.58 64,51.58 64.88,52.45 64.88,54.58 v65.25,54.95 | v56.5,67.45 v56.5,65.45 | v56.25,76.08 56.25,80.33 58.25,82.33 U4.2
  Bottom 0.152: v67.5,41.83 67.5,43.7 63,48.2 v62.88,48.2 | v61.75,49.95 61.75,52.2 v61.5,52.45 | v65.25,54.95 65.25,59.58 59.38,65.45 v56.5,65.45 | v56.5,67.45 56.5,74.33 56.25,74.58 v56.25,76.08
N$30
  Top 0.152: SW5.6 86,28.95 83.62,28.95 SW5.5 83.5,28.95 81.12,28.95 SW5.4 81,28.95 78.88,31.07 77.38,31.07 R10.2
N$31  (via drill 0.35)
  Top 0.152: v69,26.07 v82.12,26.07 | v68.12,26.95 59.75,18.57 v42,18.57 | v31.75,40.83 31.75,53.45 v30.5,54.7 | v30.5,61.83 30.5,63.08 v33.38,65.95 | v35.25,64.08 39.62,64.08 40,64.45 52.5,64.45 56.75,68.7 59.75,68.7 62.38,71.33 v66.25,71.33
  Bottom 0.152: v82.12,26.07 82.12,29.82 81.12,30.82 81.12,36.45 SW5.3 | v68.12,26.95 v69,26.07 | v42,18.57 31.75,28.82 v31.75,40.83 | v30.5,61.83 v30.5,54.7 | v35.25,64.08 v33.38,65.95 | v66.25,71.33 69.88,74.95 69.88,75.08 71.12,76.33 71.88,76.33 74.12,78.58 74.75,78.58 76,77.33 U5.4
N$32  (via drill 0.35)
  Top 0.152: v127.62,40.08 123.75,36.2 99.12,36.2 97.5,34.58 86.12,34.58 84.25,36.45 83.62,36.45 SW5.2 | v124.25,44.95 117,44.95 100.75,61.2 v98.88,61.2 | v98.5,65.83 98.5,66.2 96.12,68.58 v92.88,68.58 | v92,69.45 91.25,68.7 87.75,68.7 82.12,74.33 82.12,76.33 81.25,77.2 v78.75,77.2
  Bottom 0.152: v127.62,40.08 127.62,41.58 v124.25,44.95 | v98.88,61.2 98.88,65.45 v98.5,65.83 | v92,69.45 v92.88,68.58 | v78.75,77.2 76.12,79.83 U5.3
N$33  (via drill 0.35)
  Top 0.152: v83.88,42.45 85.75,42.45 88,44.7 89,44.7 v90.12,45.83 | v84.75,62.83 84.75,63.58 79.25,69.08 79.25,71.83 v80.5,73.08
  Bottom 0.152: v83.88,42.45 86,40.33 86,36.58 SW5.1 | v90.12,45.83 90.12,47.33 92,49.2 92,49.7 89.75,51.95 86.38,51.95 84.75,53.58 v84.75,62.83 | v80.5,73.08 79.62,73.95 79.62,78.83 76.12,82.33 U5.2
N$34  (via drill 0.35)
  Top 0.152: v25.75,84.58 26.75,84.58 R22.2 | v10,80.08 v10,56.95
  Bottom 0.152: v25.75,84.58 22,84.58 21.62,84.95 U2.1 21.5,85.08 21.5,86.95 20.62,87.83 17.75,87.83 v10,80.08 | JP6.1 24.5,39.2 21.88,41.83 21.88,42.45 21.5,42.83 20.75,42.83 19.5,41.58 18.75,41.58 17.62,42.7 17.62,43.83 16.5,44.95 16.12,44.95 10,51.08 v10,56.95
N$35  (via drill 0.35)
  Top 0.152: v116.38,94.2 114.62,92.45 88.5,92.45 v86.25,90.2 | v78.5,93.2 43,93.2 40.88,91.08 16.25,91.08 10.12,84.95 10.12,83.58 4.88,78.33 4.88,77.08 3.75,75.95 3.38,75.95 2.75,75.33 2.75,68.33 3.75,67.33 U1.8
  Bottom 0.152: v116.38,94.2 128.12,94.2 131.62,90.7 131.62,89.95 130.62,88.95 130.62,87.83 J1.29 | v86.25,90.2 85.88,90.2 85.25,89.58 82.12,89.58 v78.5,93.2
N$36  (via drill 0.35)
  Top 0.152: 40.38,84.7 45.5,84.7 R23.2 | 40.38,84.7 40.12,84.95 U3.1 40.38,84.7 | v34.12,55.2 34.12,56.45 35.12,57.45 35.5,57.45 36.38,58.33 36.38,59.45 v38.75,61.83 | v38.12,70.95 38.12,78.58 39.12,79.58 39.12,83.45 40.38,84.7
  Bottom 0.152: JP7.1 42.25,39.83 36.25,45.83 36.25,46.33 35.25,47.33 34.75,47.33 34.12,47.95 v34.12,55.2 | v38.75,61.83 38.75,65.2 38.12,65.83 v38.12,70.95
N$37  (via drill 0.35)
  Top 0.152: v92.12,75.45 v92.12,77.95
  Bottom 0.152: v92.12,77.95 92.12,79.58 93.75,81.2 95.75,81.2 102.25,87.7 102.5,87.7 J1.7 | v92.12,75.45 93.5,74.08 93.5,73.58 93.12,73.2 92.12,73.2 91.38,73.95 89.38,73.95 88.75,73.33 85,73.33 81.38,69.7 U5.7
N$38  (via drill 0.35)
  Top 0.152: v113.25,75.33 113.25,67.08 v104.5,58.33 | v100,53.83 100,52.58 99.12,51.7 97.25,51.7 v97.12,51.83 | v86,53.2 86,51.83 80.5,46.33 v80.12,46.33 | v68,49.58 67,50.58 66.5,50.58 64.5,48.58 64.5,47.95 63.62,47.08 57.88,47.08 57.25,46.45 57.25,44.45 58.25,43.45 U9.8
  Bottom 0.152: v113.25,75.33 113.25,83.08 109.12,87.2 109.12,88.33 107.75,89.7 107.75,90.33 J1.12 | v100,53.83 v104.5,58.33 | v97.12,51.83 96.75,51.83 96.12,51.2 91,51.2 89.88,52.33 86.88,52.33 v86,53.2 | v80.12,46.33 80.12,46.08 76.25,42.2 73,42.2 72,43.2 72,43.83 70.88,44.95 70.5,44.95 68,47.45 v68,49.58
N$39  (via drill 0.35)
  Top 0.508: v172.12,48.2 v174.62,45.7 | v167.25,62.83 167.25,63.58 167.75,64.08 167.75,67.2 165.38,69.58 v163,69.58 | v154.75,69.83 147.38,77.2 147.38,81.2 v145,83.58 | v85.38,94.95 81.62,91.2 55.12,91.2 53.38,89.45 39.62,89.45 38.75,88.58 38.5,88.58 37.62,87.7 37.62,83.2 34.38,79.95 U2.14
  Bottom 0.508: v174.62,45.7 174.62,41.45 U$2.P4 | v172.12,48.2 172.12,48.45 170.62,49.95 170.62,55.95 169.75,56.83 168.88,56.83 167.25,58.45 v167.25,62.83 | v163,69.58 159.25,69.58 159,69.83 v154.75,69.83 | v145,83.58 144.62,83.95 134.38,83.95 133.88,83.45 130.25,83.45 124.25,77.45 123.25,77.45 120.62,80.08 117.25,80.08 116.5,80.83 116.5,84.95 114,87.45 114,90.83 112,92.83 110,92.83 107.88,94.95 v85.38,94.95
N$40  (via drill 0.35)
  Top 0.508: v163.12,34.58 v168.88,34.58 | v153.5,27.2 v159.12,27.2 | v140,20.57 131.75,20.57 130.88,19.7 117.62,19.7 v117.5,19.82 | v103.5,5.83 v109.88,12.2 | v100.62,2.95 85.38,2.95 80,8.32 40.62,8.32 v32,16.95 | v16.5,27.2 16.5,41.7 14.75,43.45 14.75,53.45 16.12,54.83 17,54.83 18.38,56.2 18.38,57.7 21.25,60.58 21.25,62.08 28.75,69.58 30,69.58 v30.88,70.45
  Bottom 0.508: v168.88,34.58 172.62,38.33 172.62,41.33 U$2.P3 | v163.12,34.58 160.38,31.82 160.25,31.82 159.12,30.7 v159.12,27.2 | v153.5,27.2 153.5,25.7 148.38,20.57 v140,20.57 | v109.88,12.2 v117.5,19.82 | v100.62,2.95 v103.5,5.83 | v32,16.95 26.75,16.95 v16.5,27.2 | v30.88,70.45 30.88,74.08 34.25,77.45 U2.13
N$41  (via drill 0.35)
  Top 0.508: v170.38,44.58 165.88,44.58 165,45.45 v164.88,45.45 | v161.5,49.33 158.5,52.33 158.5,53.58 v158.25,53.83 | v103.5,70.58 97.75,76.33 v92.75,76.33 | v77.38,77.33 v80.25,74.45 | v73.75,80.45 73.75,84.83 73,85.58 v72.25,85.58 | v42.88,87.83 40,87.83 38.38,86.2 38.38,79.58 35.88,77.08 35.88,73.95 34.38,72.45 U2.11
  Bottom 0.508: v170.38,44.58 170.62,44.33 170.62,41.45 U$2.P2 | v164.88,45.45 164.88,45.95 v161.5,49.33 | v158.25,53.83 152.25,59.83 152.25,61.2 151.38,62.08 147,62.08 143.5,65.58 141.5,65.58 137.25,69.83 104.25,69.83 v103.5,70.58 | v92.75,76.33 91,76.33 90,77.33 90,77.83 89.25,78.58 86.75,78.58 84.88,76.7 84.88,74.83 84.5,74.45 v80.25,74.45 | v77.38,77.33 77.38,77.7 76.5,78.58 75.62,78.58 v73.75,80.45 | v72.25,85.58 68.38,89.45 44.5,89.45 v42.88,87.83
N$42  (via drill 0.35)
  Top 0.508: v185,48.83 185,41.45 U$3.P4 | v183.5,50.33 183.5,58.33 v184.25,59.08 | v194.62,78.45 192.5,80.58 v190.38,80.58 | v185.12,88.83 177.88,96.08 v135.38,96.08 | v89.25,97.7 89.25,96.58 82.5,89.83 68.38,89.83 66.12,87.58 62.12,87.58 61.5,86.95 56.38,86.95 53.25,83.83 52.38,83.83 51.5,82.95 v51.5,82.33
  Bottom 0.508: v183.5,50.33 v185,48.83 | v184.25,59.08 188.25,59.08 194.62,65.45 v194.62,78.45 | v190.38,80.58 190.38,83.33 188.25,85.45 188.25,85.7 v185.12,88.83 | v135.38,96.08 134.75,96.08 133.12,97.7 v89.25,97.7 | v51.5,82.33 51.5,81.33 52.75,80.08 U3.14
N$43  (via drill 0.35)
  Top 0.508: v175.5,43.2 150.38,43.2 148.62,44.95 v145.38,44.95 | v110.75,47.83 97.38,61.2 v91.25,61.2 | v75.5,64.33 71.38,68.45 70.25,68.45 v64.88,73.83
  Bottom 0.508: v175.5,43.2 181.38,43.2 182.12,42.45 182.12,42.33 183,41.45 U$3.P3 | v145.38,44.95 144.38,45.95 113.62,45.95 111.75,47.83 v110.75,47.83 | v91.25,61.2 88,64.45 75.62,64.45 v75.5,64.33 | v64.88,73.83 61,73.83 58.75,76.08 57.38,76.08 56,77.45 U3.13
N$44  (via drill 0.35)
  Top 0.508: v181,45.08 181,41.45 U$3.P2 | v176,52.08 v176,49.7 | v172,61.08 172,65.95 172.12,66.08 172.12,68.83 168.88,72.08 v168.88,74.45 | v90.25,96.58 82.75,89.08 71.38,89.08 69.12,86.83 62.38,86.83 61.75,86.2 57.38,86.2 54,82.83 54,73.58 52.88,72.45 U3.11
  Bottom 0.508: v181,45.08 176.38,49.7 v176,49.7 | v176,52.08 176,56.45 172,60.45 v172,61.08 | v168.88,74.45 165,78.33 161,78.33 155,84.33 155,88.33 148.25,95.08 133.5,95.08 132,96.58 v90.25,96.58
N$45  (via drill 0.35)
  Top 0.508: v180.75,67.83 181.62,66.95 182.5,66.95 183.25,66.2 183.25,61.33 185.12,59.45 185.12,50.7 179.12,44.7 179.12,41.45 U$3.P1 | v164.75,71.83 v166.75,69.83 | v148,73.08 147.75,73.08 144.5,76.33 v137.75,76.33 | v112,82.83 v115.62,82.83 | v108.5,85.33 105.88,85.33 103.88,87.33 v103.88,91.45 | v85.62,87.95 83.75,87.95 83.38,87.58 75.88,87.58 74.75,86.45 v69.88,86.45 | v48,83.58 48,79.7 52.75,74.95 U3.12
  Bottom 0.508: v180.75,67.83 180,67.83 178,65.83 177.38,65.83 175.75,67.45 172.25,67.45 169.75,69.95 166.88,69.95 v166.75,69.83 | v164.75,71.83 163.5,73.08 v148,73.08 | v137.75,76.33 125.38,76.33 125,76.7 123,76.7 120.38,79.33 117,79.33 115.62,80.7 v115.62,82.83 | v112,82.83 111.75,82.83 109.25,85.33 v108.5,85.33 | v103.88,91.45 103.38,91.95 89.62,91.95 v85.62,87.95 | v69.88,86.45 65.25,86.45 62.5,83.7 56.25,83.7 53.62,86.33 50.75,86.33 v48,83.58
N$46  (via drill 0.35)
  Top 0.508: v179.12,45.83 v180.75,47.45 | v172.88,48.83 v175.88,45.83 | v166.88,64.33 166.88,66.95 v165.38,68.45 | v107.25,74.83 v109.88,74.83 | v91.12,73.33 91.12,73.7 v90.25,74.58 | v86,76.7 84.12,78.58 v79,78.58
  Bottom 0.508: v180.75,47.45 186,47.45 189.88,43.58 193.38,43.58 195.25,41.7 195.25,41.45 U$4.P4 | v175.88,45.83 v179.12,45.83 | v172.88,48.83 172.88,56.2 169.75,59.33 168.88,59.33 168.12,60.08 168.12,63.08 v166.88,64.33 | v165.38,68.45 165.38,68.95 163.38,70.95 144.75,70.95 144.38,71.33 116,71.33 112.5,74.83 v109.88,74.83 | v107.25,74.83 101.75,74.83 99.88,72.95 99.5,72.95 97.25,70.7 96.75,70.7 96.12,71.33 93.12,71.33 v91.12,73.33 | v90.25,74.58 90.25,75.08 89.25,76.08 86.62,76.08 v86,76.7 | v79,78.58 77.25,80.33 77.25,80.45 76.5,81.2 74.12,81.2 74,81.33 72.38,81.33 71,79.95 U4.14
N$47  (via drill 0.35)
  Top 0.508: v198.25,43.2 194.88,43.2 193.38,41.7 193.38,41.45 U$4.P3 | v211.12,48.08 v204.12,48.08 | v198.75,9.45 v211.12,21.82 | v149.88,9.95 v152.5,7.33 | v111.5,44.95 97,59.45 v91.88,59.45 | v68.75,66.95 68.75,68.95 67.12,70.58 v67,70.58 | v69.75,73.33 69.75,76.08 70.88,77.2 U4.13
  Bottom 0.508: v198.25,43.2 199.25,43.2 v204.12,48.08 | v211.12,21.82 v211.12,48.08 | v198.75,9.45 198.75,7.58 197.5,6.33 153.5,6.33 v152.5,7.33 | v149.88,9.95 146.38,9.95 111.5,44.83 v111.5,44.95 | v91.88,59.45 87.62,63.7 76,63.7 75.75,63.45 71.38,63.45 70.25,64.58 69.38,64.58 68.75,65.2 v68.75,66.95 | v69.75,73.33 v67,70.58
N$48  (via drill 0.35)
  Top 0.508: v192.12,46.45 191.38,45.7 191.38,41.45 U$4.P2 | v190.25,51.2 190.25,51.45 196.38,57.58 v196.38,66.33 | v198.38,75.83 v196.38,73.83 | v196.25,88.08 196.5,88.08 196.62,87.95 197.12,87.95 197.75,88.58 197.75,89.08 188.12,98.7 89.88,98.7 89.75,98.83 85.12,98.83 81.88,95.58 v81.88,94.2 | v85,90.2 83.12,88.33 75.5,88.33 v74.5,87.33 | v72.88,84.58 72.88,74.2 71,72.33 U4.11
  Bottom 0.508: v192.12,46.45 192.12,49.33 v190.25,51.2 | v196.38,73.83 v196.38,66.33 | v198.38,75.83 198.38,85.95 v196.25,88.08 | v81.88,94.2 81.88,93.33 v85,90.2 | v74.5,87.33 74.5,86.2 v72.88,84.58
N$49  (via drill 0.35)
  Top 0.508: v190.12,44.45 189.38,43.7 189.38,41.45 U$4.P1 | v177.62,56.95 171.38,50.7 171.38,49.58 168.88,47.08 153.62,47.08 v153.12,47.58 | v147.88,42.33 144.88,42.33 144.75,42.45 98.5,42.45 v97,43.95 | v98.62,47.2 98.62,48.58 v98,49.2 | v89.38,65.33 88.88,65.33 85.5,68.7 85.5,68.83 82.75,71.58 v79.88,71.58
  Bottom 0.508: v190.12,44.45 190.12,44.83 183.25,51.7 181.62,51.7 180.25,53.08 180.25,54.33 v177.62,56.95 | v147.88,42.33 v153.12,47.58 | v97,43.95 97,45.58 v98.62,47.2 | v98,49.2 98,54.2 97,55.2 97,57.83 92.75,62.08 92.5,62.08 89.38,65.2 v89.38,65.33 | v79.88,71.58 78.5,71.58 76.5,73.58 72.12,73.58 71,74.7 U4.12
N$50  (via drill 0.35)
  Top 0.508: v194.12,48.45 199.62,42.95 199.62,41.58 U$5.P1 | v190.12,64.58 v190.12,52.45 | v145.12,71.83 144.5,71.2 141,71.2 v136.88,67.08 | v104.62,68.2 104.62,70.58 v100.5,74.7 | v97,71.58 96.5,71.58 96.25,71.33 93.75,71.33 92,73.08 92,73.95 90.5,75.45 89.5,75.45 88.88,74.83 U5.12
  Bottom 0.508: v190.12,52.45 v194.12,48.45 | v190.12,64.58 187.88,66.83 185.12,66.83 181.38,70.58 171.88,70.58 169.88,72.58 165.12,72.58 163.75,73.95 147.25,73.95 v145.12,71.83 | v136.88,67.08 134.25,67.08 133.75,67.58 106.75,67.58 106.25,67.08 105.75,67.08 v104.62,68.2 | v100.5,74.7 100.12,74.7 v97,71.58
N$51  (via drill 0.35)
  Top 0.508: v203,45.2 203,61.83 200.62,64.2 199.62,64.2 188.75,75.08 186.5,75.08 v183.25,78.33 | v146.5,97.83 122.38,97.83 116.12,91.58 109.75,91.58 109,90.83 v109,89.7 | v109.75,83.2 v111.88,85.33 | v110.62,71.7 111.38,70.95 111.38,68.33 105.12,62.08 97.75,62.08 96.12,63.7 93.25,63.7 93.12,63.83 92.38,63.83 v92.12,63.58
  Bottom 0.508: v203,45.2 201.75,43.95 201.75,41.58 U$5.P2 | v183.25,78.33 178.88,82.7 178.88,85.58 175.5,88.95 158.62,88.95 157.12,87.45 156.62,87.45 155.75,88.33 155.75,88.58 v146.5,97.83 | v109,89.7 109.62,89.08 110.62,89.08 111.5,88.2 111.5,85.7 v111.88,85.33 | v109.75,83.2 109,82.45 109,73.33 v110.62,71.7 | v92.12,63.58 91.38,64.33 91.25,64.33 90.62,64.95 90.62,66.45 91,66.83 91,67.95 90,68.95 90,71.08 88.88,72.2 U5.11
N$52  (via drill 0.35)
  Top 0.508: v190.62,36.08 198.5,36.08 203.62,41.2 203.62,41.45 U$5.P3 | v170.25,39.45 v173.62,36.08 | v162,36.95 v167.75,36.95 | v158.25,33.2 151.88,33.2 151.62,32.95 149.75,32.95 144.38,38.33 131.38,38.33 128.75,40.95 127.12,40.95 v127,40.83 | v105.88,55.2 v116,45.08 | v105.88,64.45 103,67.33 v103,67.58 | v98.12,69.95 98.12,71.95 96.25,73.83 v92.88,73.83
  Bottom 0.508: v173.62,36.08 v190.62,36.08 | v167.75,36.95 v170.25,39.45 | v158.25,33.2 v162,36.95 | v127,40.83 127,41.08 123,45.08 v116,45.08 | v105.88,64.45 v105.88,55.2 | v103,67.58 100.5,67.58 v98.12,69.95 | v92.88,73.83 92.5,73.83 89.12,77.2 88.88,77.2 U5.13
N$53  (via drill 0.35)
  Top 0.508: v201.75,61.95 201.75,45.33 202.75,44.33 203,44.33 204.75,42.58 204.75,42.45 205.62,41.58 U$5.P4 | v202.12,65.95 202.12,67.95 201.62,68.45 v201.62,79.08 | v196.88,88.83 188.75,96.95 134.38,96.95 134.25,97.08 122.88,97.08 116.5,90.7 116.5,89.83 115.75,89.08 109.75,89.08 109,88.33 109,85.95 109.38,85.58 109.38,85.08 108.75,84.45 v104.5,84.45 | v101.88,84.45 101.25,84.45 100.88,84.08 99.5,84.08 v98.62,84.95 | v92,86.95 92,85.08 90.75,83.83 90.75,81.7 88.88,79.83 U5.14
  Bottom 0.508: v201.75,61.95 201.75,63.08 200.62,64.2 199.75,64.2 199,64.95 199,65.95 199.75,66.7 200.88,66.7 201.62,65.95 v202.12,65.95 | v201.62,79.08 201.62,84.08 v196.88,88.83 | v101.88,84.45 v104.5,84.45 | v98.62,84.95 96.25,87.33 96.25,88.7 95.88,89.08 94.12,89.08 v92,86.95
N$54  (via drill 0.35)
  Top 0.152: 59.75,84.58 58.62,84.58 58.38,84.83 U4.1 | 59.75,84.58 63.75,84.58 R24.2 | v60.75,50.08 v60.75,48.2 | v64,59.45 64.5,59.95 v64.5,62.45 | v59.12,73.7 59.12,74.2 59.75,74.83 59.75,84.58
  Bottom 0.152: JP8.1 59.75,42.83 60.75,43.83 v60.75,48.2 | v60.75,50.08 60.75,55.2 61.5,55.95 61.5,56.95 v64,59.45 | v64.5,62.45 58.25,68.7 57.88,68.7 57.25,69.33 57.25,72.7 58.25,73.7 v59.12,73.7
N$55  (via drill 0.35)
  Top 0.152: v29.25,56.83 33.62,52.45 35.12,52.45 36.62,50.95 36.62,30.45 33.62,27.45 33.62,20.82 SW7.1
  Bottom 0.152: v29.25,56.83 24.12,56.83 22.5,58.45 U7.2
N$56  (via drill 0.35)
  Top 0.152: SW8.4 46.38,12.7 48.75,12.7 SW8.5 48.88,12.7 51.25,12.7 SW8.6 51.38,12.57 52.25,11.7 69.62,11.7 76.88,18.95 77.88,18.95 78.12,18.7 v83.75,18.7 | v186.38,78.2 186.38,79.45 R16.2 | v183.62,75.45 167.5,75.45 162.38,70.33 v162.38,68.2 | v154.38,58.83 152.5,56.95 152.5,45.2 v152.75,44.95 | v129.75,32.95 129.38,32.95 117.62,21.2 99.88,21.2 95.5,16.82 v85.62,16.82
  Bottom 0.152: v183.62,75.45 v186.38,78.2 | v162.38,68.2 162.38,67.45 160.88,65.95 160.88,65.83 160.5,65.45 157.62,65.45 155,62.83 155,59.45 v154.38,58.83 | v152.75,44.95 152.75,44.33 144,35.58 141.75,35.58 139.12,32.95 v129.75,32.95 | v83.75,18.7 v85.62,16.82
N$57  (via drill 0.35)
  Top 0.152: v43.12,23.45 43.12,29.32 38.5,33.95 38.5,41.08 38.25,41.33 38.25,51.7 40.12,53.58 U8.4
  Bottom 0.152: v43.12,23.45 46.25,20.32 SW8.3
N$58  (via drill 0.35)
  Top 0.152: v37.88,34.7 37.88,52.45 v36.75,53.58
  Bottom 0.152: v37.88,34.7 48.75,23.82 48.75,20.32 SW8.2 | v36.75,53.58 37.12,53.58 39.62,56.08 40.12,56.08 U8.3
N$59  (via drill 0.35)
  Top 0.152: v43.5,35.08 v47.75,30.82 | v43.5,38.58 39.12,42.95 39.12,46.45 40.12,47.45 40.62,47.45 41.25,48.08 41.25,53.95 40.12,55.08 39.75,55.08 38,56.83 38,59.83 38.38,60.2 38.88,60.2 40.12,58.95 40.12,58.7 U8.2
  Bottom 0.152: v47.75,30.82 48.88,30.82 49.5,30.2 49.5,28.2 51.25,26.45 51.25,20.32 SW8.1 | v43.5,38.58 v43.5,35.08
N$60  (via drill 0.35)
  Top 0.152: SW9.4 64.25,13.32 66.62,13.32 SW9.5 66.75,13.32 69.12,13.32 SW9.6 | v208.12,58.45 206.62,59.95 206.62,68.7 203.12,72.2 203.12,79.45 R18.2 | v194.88,28.2 194.88,21.95 192.38,19.45 192.38,12.45 189,9.07 189,6.83 v186.25,4.08 | v133,4.08 132.12,4.08 131,5.2 98.75,5.2 98,4.45 85.62,4.45 78.5,11.57 v70.88,11.57
  Bottom 0.152: v208.12,58.45 208.12,52.7 209,51.83 209,44.58 206.62,42.2 206.62,39.95 v194.88,28.2 | v133,4.08 v186.25,4.08 | v70.88,11.57 69.25,13.2 SW9.6
N$61  (via drill 0.35)
  Top 0.152: v61,32.7 62,31.7 67.88,31.7 69.62,29.95 69.62,27.57 64.25,22.2 64.25,20.95 SW9.3 | v57.38,36.33 57.38,42.83 56.88,43.33 56.88,46.58 57.75,47.45 58.62,47.45 59.62,48.45 v59.62,51.2
  Bottom 0.152: v57.38,36.33 v61,32.7 | v59.62,51.2 59.62,51.7 59.75,51.83 59.75,52.33 58.38,53.7 U9.4
N$62  (via drill 0.35)
  Top 0.152: v61.62,17.07 62.38,17.07 66.12,20.82 66.62,20.82 SW9.2 | v52.25,30.7 52.25,32.08 56.88,36.7 56.88,42.83 55.75,43.95 v55.75,51.95
  Bottom 0.152: v61.62,17.07 59.38,17.07 55,21.45 55,27.95 v52.25,30.7 | v55.75,51.95 55.75,52.83 55.62,52.95 55.62,53.45 58.25,56.08 U9.3
N$63  (via drill 0.35)
  Top 0.152: v62.38,15.95 64.25,15.95 69.12,20.82 SW9.1 | v50.12,30.57 53.38,33.83 53.5,33.83 56.5,36.83 56.5,40.33 54.12,42.7 54.12,48.7 52.88,49.95 52.5,49.95 51.88,50.58 v51.88,51.95
  Bottom 0.152: v62.38,15.95 60,15.95 54.62,21.32 54.62,25.95 53,27.57 50.62,27.57 50.12,28.07 v50.12,30.57 | v51.88,51.95 51.88,54.08 52.88,55.08 53.62,55.08 57.12,58.58 58.25,58.58 U9.2
N$64  (via drill 0.35)
  Top 0.152: SW10.4 81.62,13.57 84,13.57 SW10.5 84.12,13.57 86.5,13.57 SW10.6 | v213.38,50.2 214.25,51.08 214.25,60.58 217.62,63.95 218.5,63.95 220.62,66.08 220.62,78.95 R20.2 | v213.38,23.2 192.5,2.33 141.5,2.33 128.75,15.07 v125.38,15.07
  Bottom 0.152: v213.38,23.2 v213.38,50.2 | v125.38,15.07 125,15.07 118.38,21.7 94.62,21.7 86.5,13.57 SW10.6
N$65  (via drill 0.35)
  Top 0.152: v78.75,38.83 73.5,44.08 v73.5,44.95
  Bottom 0.152: v78.75,38.83 78.75,29.2 81.5,26.45 81.5,21.2 SW10.3 | v73.5,44.95 71,47.45 70.5,47.45 69.88,48.08 69.88,56.58 70.5,57.2 72,57.2 75.75,53.45 U10.4
N$66  (via drill 0.35)
  Top 0.152: v80.88,24.32 84,21.2 SW10.2 | v68.12,41.08 v69.88,39.33 | v66.88,43.45 66.88,45.95 70.88,49.95 71.38,49.95 74.75,53.33 74.75,54.83 75.75,55.83 U10.3
  Bottom 0.152: v80.88,24.32 80.88,26.32 72.62,34.58 72.62,36.58 v69.88,39.33 | v68.12,41.08 67.38,41.08 66.88,41.58 v66.88,43.45
N$67  (via drill 0.35)
  Top 0.152: v69.62,40.58 v70.88,39.33 | v66.12,44.2 66.12,46.83 69.88,50.58 69.88,53.95 71,55.08 71.75,55.08 75.12,58.45 75.75,58.45 U10.2
  Bottom 0.152: v70.88,39.33 77.12,39.33 80,42.2 83.25,42.2 83.62,41.83 83.62,41.33 82.62,40.33 82.62,27.82 86.5,23.95 86.5,21.2 SW10.1 | v69.62,40.58 68.5,40.58 68.38,40.45 67.5,40.45 66.12,41.83 v66.12,44.2
N$68
  Top 0.152: SW6.4 9.88,13.57 12.38,13.57 SW6.5 12.5,13.57 14.88,13.57 SW6.6 15,13.45 26.88,1.57 111.38,1.57 111.75,1.2 217.12,1.2 238.75,22.82 238.75,79.58 229.38,88.95 203.12,88.95 201.62,87.45 163.25,87.45 158.38,82.58 150.5,82.58 149.38,81.45 149.38,80.08 150,79.45 150,79.2 R12.2
N$69
  Bottom 0.152: U6.4 1.62,51.33 1.62,34.45 9.75,26.32 9.75,21.2 SW6.3
N$70  (via drill 0.35)
  Top 0.152: v2.25,51.08 2.25,54.58 3.75,56.08 U6.3
  Bottom 0.152: v2.25,51.08 2.25,34.33 12.38,24.2 12.38,21.2 SW6.2
N$71
  Bottom 0.152: SW6.1 14.88,21.2 14.88,22.2 2.88,34.2 2.88,51.45 4,52.58 4.38,52.58 4.88,53.08 4.88,57.58 3.88,58.58 U6.2
N$72  (via drill 0.35)
  Top 0.152: v107.88,73.08 107.88,68.45 v105.5,66.08 | v97.62,63.58 v100.12,63.58 | v92.88,62.95 92.12,62.95 90.25,61.08 90.25,58.7 89,57.45 86.25,57.45 v84,59.7 | v66.88,48.95 66,48.95 63.12,46.08 58.38,46.08 U9.7
  Bottom 0.152: v107.88,73.08 107.88,85.58 108.75,86.45 108.75,88.2 108.12,88.83 107.75,88.83 106.62,89.95 106.62,90.7 107.38,91.45 108,91.45 109,90.45 110.12,90.45 J1.14 | v105.5,66.08 102.62,66.08 v100.12,63.58 | v97.62,63.58 96.38,63.58 96.25,63.45 93.38,63.45 v92.88,62.95 | v84,59.7 84,60.7 82.38,62.33 73.5,62.33 70.88,59.7 70.5,59.7 67.38,56.58 67.38,49.45 v66.88,48.95
N$73  (via drill 0.35)
  Top 0.508: v134.25,13.95 v160.25,13.95 | v27.5,46.2 27.5,49.7 v23.88,53.33
  Bottom 0.508: v160.25,13.95 161,14.7 161,19.7 165,23.7 165,24.95 U$6.P4 | v134.25,13.95 128.25,13.95 125.62,11.32 107.88,11.32 98.12,1.57 84.75,1.57 71,15.32 64.5,15.32 61.88,17.95 59.25,17.95 55.5,21.7 55.5,28.57 52.38,31.7 42,31.7 v27.5,46.2 | v23.88,53.33 23.88,53.83 22.88,54.83 17.88,54.83 16.62,56.08 U6.14
N$74  (via drill 0.35)
  Top 0.508: v115.5,19.82 116.38,20.7 118.62,20.7 118.88,20.45 130.62,20.45 133.12,22.95 144.38,22.95 151.12,29.7 161.38,29.7 163,28.07 163,25.07 U$6.P3 | v26.62,48.58 23,52.2 21.75,52.2 v20.75,53.2
  Bottom 0.508: v115.5,19.82 108.88,13.2 108.75,13.2 97.88,2.33 85,2.33 71.25,16.07 64.75,16.07 62.12,18.7 59.5,18.7 56.25,21.95 56.25,28.82 52.62,32.45 42.25,32.45 28.38,46.33 28.38,46.83 v26.62,48.58 | v20.75,53.2 16.88,53.2 16.62,53.45 U6.13
N$75  (via drill 0.35)
  Top 0.508: v148.38,21.7 158,21.7 161,24.7 161,24.95 U$6.P2 | v135.62,27.2 133.38,27.2 v127.5,21.32
  Bottom 0.508: v148.38,21.7 144.5,25.57 137.25,25.57 v135.62,27.2 | v127.5,21.32 127.5,16.07 125.62,14.2 125.12,14.2 118.62,20.7 115.25,20.7 113.5,18.95 113.5,18.82 108.88,14.2 108.75,14.2 97.62,3.08 85.25,3.08 71.5,16.82 67.88,16.82 67.12,17.57 64.38,17.57 63.5,18.45 63.38,18.45 62.38,19.45 59.75,19.45 57,22.2 57,29.07 52.88,33.2 42.5,33.2 31,44.7 31,46.33 27.88,49.45 25.25,49.45 23,47.2 17.88,47.2 16.62,48.45 U6.11
N$76  (via drill 0.35)
  Top 0.508: v112.62,19.07 112.75,18.95 142.88,18.95 152.88,28.95 161.12,28.95 161.75,28.32 161.75,27.82 161.12,27.2 161,27.2 159.12,25.32 159.12,25.07 U$6.P1
  Bottom 0.508: v112.62,19.07 97.38,3.83 85.5,3.83 71.75,17.57 68.25,17.57 67.5,18.32 66,18.32 65.25,19.07 63.75,19.07 59.75,23.07 59.75,27.32 53.12,33.95 42.75,33.95 33.75,42.95 33.75,44.58 28.12,50.2 23.5,50.2 23,49.7 17.88,49.7 16.62,50.95 U6.12
N$77  (via drill 0.35)
  Top 0.508: v154.25,42.33 v169,27.57 | v153.38,44.08 150.5,44.08 148.75,45.83 142,45.83 140.12,43.95 123,43.95 v122.88,44.08 | v119.62,40.83 117.75,40.83 116.88,39.95 101.62,39.95 101.38,40.2 99.5,40.2 96.88,37.58 91,37.58 87,41.58 v83,41.58 | v73.38,34.83 69.25,34.83 69.12,34.7 v62.5,34.7 | v58,42.08 v61,39.08 | v49.62,48.58 46.88,48.58 v43.25,52.2